# Altium schematic sheet PSU.SchDoc
size A4
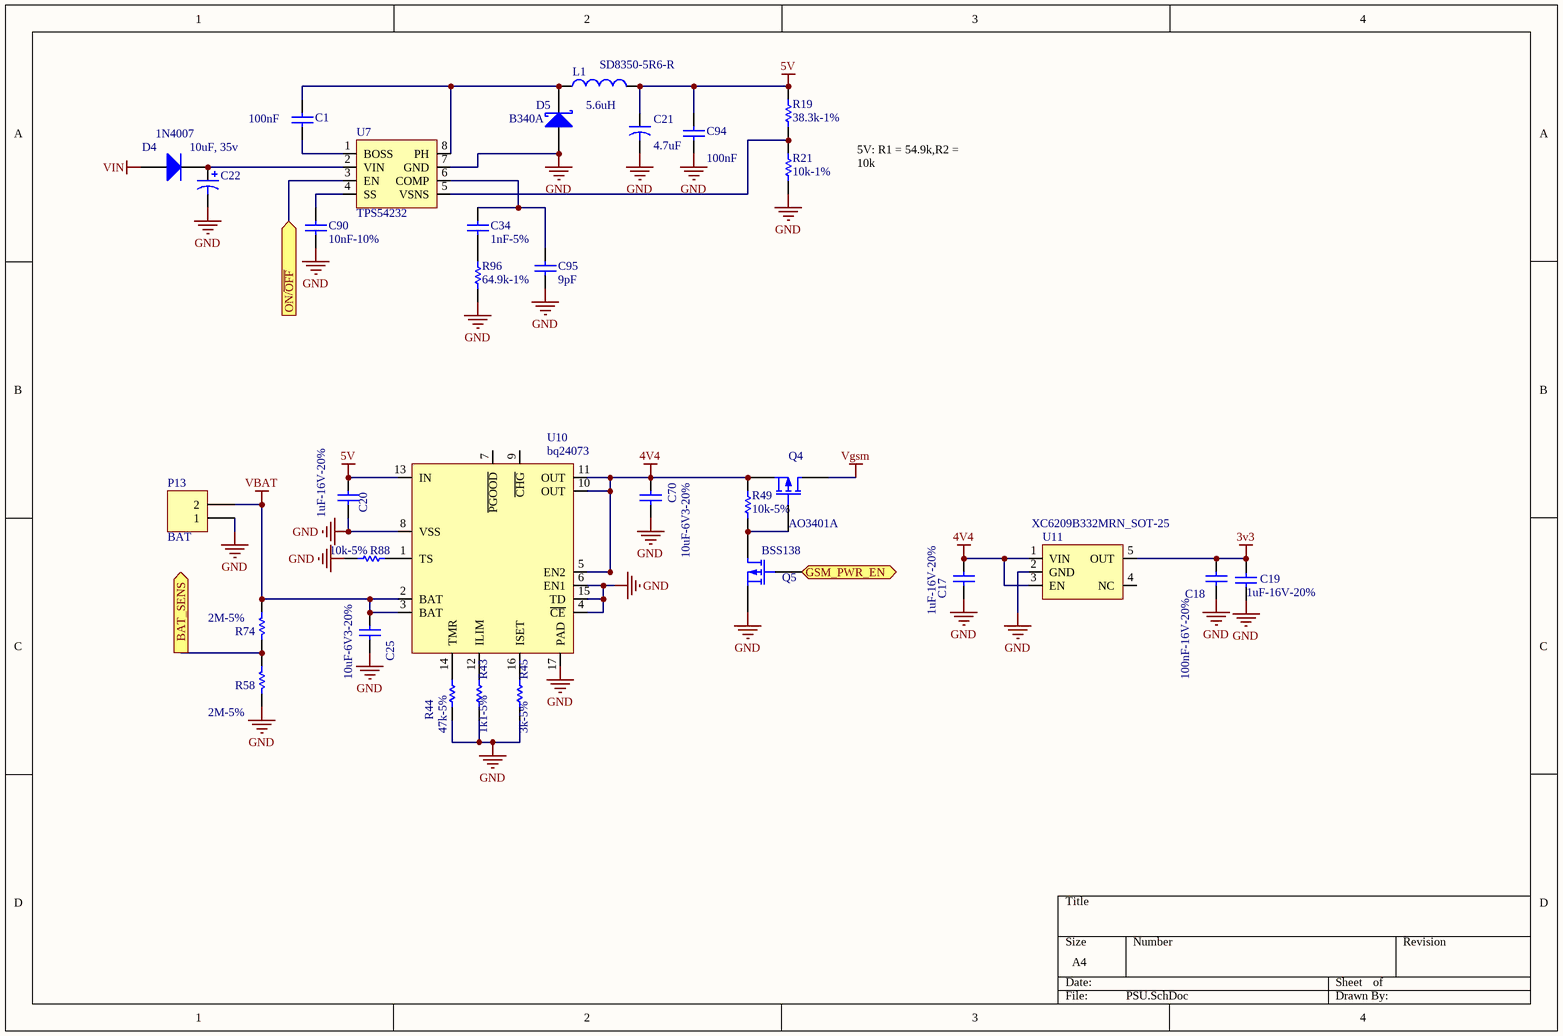
[diagram p0: PSU.SchDoc]

## Parts
C1  100nF  [0402_TYPE1]
C17  1uF-16V-20%  [C0603]
C18  100nF-16V-20%  [0402_TYPE1]
C19  1uF-16V-20%  [C0603]
C20  1uF-16V-20%  [C0603]
C21  4.7uF  [C1206]
C22  10uF, 35v  [CAPACITOR SIZE_C(D5.3)]
C25  10uF-6V3-20%  [C0603]
C34  1nF-5%  [0402_TYPE1]
C70  10uF-6V3-20%  [C0603]
C90  10nF-10%  [0402_TYPE1]
C94  100nF  [0402_TYPE1]
C95  9pF  [0402_TYPE1]
D4  1N4007  [DO-214AC (SMA)]
D5  B340A  [DO-214AC (SMA)]
L1  SD8350-5R6-R  value 5.6uH  [SD8350-5R6-R]
P13  BAT  [HDR1X2]
Q4  AO3401A  [SOT23-3]
Q5  BSS138  [SOT23-3]
R19  38.3k-1%  [R0402_TYPE1]
R21  10k-1%  [R0402_TYPE1]
R43  1k1-5%  [R0402_TYPE1]
R44  47k-5%  [R0402_TYPE1]
R45  3k-5%  [R0402_TYPE1]
R49  10k-5%  [R0402_TYPE1]
R58  2M-5%  [R0402_TYPE1]
R74  2M-5%  [R0402_TYPE1]
R88  10k-5%  [R0402_TYPE1]
R96  64.9k-1%  [R0402_TYPE1]
U7  TPS54232  [SOIC127P600-8AL]
U10  bq24073  [pq24073]
U11  XC6209B332MRN_SOT-25  [SOT23-5]

## Ports
BAT_SENS (out), GSM_PWR_EN (in), ON/~{OFF} (in)

## Nets
3v3: C18.2 C19.1 U11.5(OUT)
4V4: C17.1 C70.2 Q4.2(S) R49.1 U10.5(EN2) U10.10(OUT) U10.11(OUT) U11.1(VIN) U11.3(EN)
5V: C20.2 C21.1 C94.2 L1.2 R19.2 U10.13(IN)
GND: C17.2 C18.1 C19.2 C20.1 C21.2 C22.2 C25.1 C70.1 C90.1 C94.1 C95.1 D5.1(A) P13.1 Q5.2(S) R21.1 R43.2 R44.2 R45.2 R58.1 R88.2 R96.1 U7.7(GND) U10.4(~{CE}) U10.6(EN1) U10.8(VSS) U10.15(TD) U10.17(PAD) U11.2(GND)
VBAT: C25.2 P13.2 R74.2 U10.2(BAT) U10.3(BAT)
Vgsm: Q4.3(D)
VIN: D4.1(A)
BAT_SENS: R58.2 R74.1 ; port BAT_SENS
GSM_PWR_EN: Q5.1(G) ; port GSM_PWR_EN
ON/~{OFF}: U7.3(EN) ; port ON/~{OFF}
NetC1_1: C1.1 D5.2(K) L1.1 U7.8(PH)
NetC1_2: C1.2 U7.1(BOSS)
NetC22_1: C22.1 D4.2(K) U7.2(VIN)
NetC34_1: C34.1 R96.2
NetC34_2: C34.2 C95.2 U7.6(COMP)
NetC90_2: C90.2 U7.4(SS)
NetQ4_1: Q4.1(G) Q5.3(D) R49.2
NetR19_1: R19.1 R21.2 U7.5(VSNS)
NetR43_1: R43.1 U10.12(ILIM)
NetR44_1: R44.1 U10.14(TMR)
NetR45_1: R45.1 U10.16(ISET)
NetR88_1: R88.1 U10.1(TS)

Not connected (* = marked no-connect by the designer): U10 7(~{PGOOD}) 9(~{CHG}); U11 4(NC)

## Notes on the sheet
- 5V: R1 = 54.9k,R2 = 10k

## Library data of the parts
C1 C94 = Cap: Capacitor; Published: 8-Jun-2000; LatestRevisionDate: 17-Jul-2002; LatestRevisionNote: Re-released for DXP Platform.; PackageReference: RAD-0.3; Publisher: Altium Limited; Value: 100nF
C17 C19 C20 = Cap: CAP CER 1UF 16V Y5V 0603; Manufacturer: Yageo; Manufacturer Part Number: CC0603ZRY5V7BB105; Published: 8-Jun-2000; LatestRevisionDate: 17-Jul-2002; LatestRevisionNote: Re-released for DXP Platform.; PackageReference: C0603; Publisher: Altium Limited; Value: 1uF-16V-20%; Digi-Key Part Number: 311-1372-1-ND; Unit Price: 0.00465
C18 = Cap: CAP CER 0.1UF 16V Y5V 0402; Manufacturer: Yageo; Manufacturer Part Number: CC0402ZRY5V7BB104; Published: 8-Jun-2000; LatestRevisionDate: 17-Jul-2002; LatestRevisionNote: Re-released for DXP Platform.; PackageReference: C0402; Publisher: Altium Limited; Value: 100nF-16V-20%; Digi-Key Part Number: 311-1047-1-ND; Unit Price: 0.00250
C21 = Cap2: Capacitor; Published: 23-Sep-2002; PackageReference: CAPR5-4X5; Publisher: Altium Limited; Value: 4.7uF
C22 = Cap Pol3: CAP ALUM 10UF 35V 20% SMD; Manufacturer: Panasonic Electronic Components; Manufacturer Part Number: EEE-1VA100SR; Published: 8-Jun-2000; LatestRevisionDate: 29-May-2009; LatestRevisionNote: IPC-7351 Footprint Added.; PackageReference: C0805; Publisher: Altium Limited; PackageDescription: Chip Capacitor; Digi-Key Part Number: PCE3947TR-ND; Unit Price: 0.07875
C25 C70 = Cap: CAP CER 10UF 6.3V 20% X5R 0603; Manufacturer: Yageo; Manufacturer Part Number: CC0603MRX5R5BB106; Published: 8-Jun-2000; LatestRevisionDate: 17-Jul-2002; LatestRevisionNote: Re-released for DXP Platform.; PackageReference: C0603; Publisher: Altium Limited; Value: 10uF-6V3-20%; Digi-Key Part Number: 311-1448-1-ND; Unit Price: 0.06176
C34 = 1nF-50V-C0805: Non-Polarized Capacitor; Manufacturer: Yageo; Manufacturer Part Number: CC0805JRNPO9BN102; Value: 1nF-5%; Digi-Key Part Number: 311-1122-1-ND; Unit Price: 0.18
C90 = 10nF-50V-C0805: Non-Polarized Capacitor; Manufacturer: Yageo; Manufacturer Part Number: CC0805KRX7R9BB103; Value: 10nF-10%; Digi-Key Part Number: 311-1136-1-ND; Unit Price: 0.1
C95 = 9pF-50V-C0805: Non-Polarized Capacitor; Manufacturer: Yageo; Manufacturer Part Number: CC0805DRNPO9BN9R0; Value: 9pF; Digi-Key Part Number: 311-1098-1-ND; Unit Price: 0.1
D4 = Diode: DIODE GEN PURPOSE 1000V 1A SMA; Manufacturer Part Number: CGRA4007-G; Manufacturer: Comchip Technology; Published: 8-Jun-2000; LatestRevisionDate: 17-Jul-2002; LatestRevisionNote: Re-released for DXP Platform.; PackageVersion: Sep-1996; PackageReference: DO-214-AA; Publisher: Altium Limited; Code_JEDEC: DO-214-AB; Value: 1N4007; Digi-Key Part Number: 641-1018-1-ND; Unit Price: 0.05130
D5 = D Schottky: DIODE SCHOTTKY 40V 3A SMA; Manufacturer Part Number: B340A-E3/61T; Manufacturer: Vishay General Semiconductor; Published: 8-Jun-2000; LatestRevisionDate: 17-Jul-2002; LatestRevisionNote: Re-released for DXP Platform.; PackageReference: DO-214-AA; Publisher: Altium Limited; Code_JEDEC: DO-214-AA; Unit Price: 0.15840; Digi-Key Part Number: B340A-E3/61TGITR-ND
L1 = Inductor: Digikey part SD8350-4R7-R; Code_IEC: 1005; Published: 8-Jun-2000; LatestRevisionDate: 29-May-2009; LatestRevisionNote: IPC-7351 Footprint Added.; PackageReference: 0402-A; Publisher: Altium Limited; PackageDescription: Chip Inductor; Code_JEITA: 0402
P13 = Header 2: Header, 2-Pin; LatestRevisionDate: 17-Jul-2002; LatestRevisionNote: Re-released for DXP Platform.; Publisher: Altium Limited
Q4 = MOSFET-P: MOSFET P-CH -30V -4.3A SOT23; Manufacturer: Alpha & Omega Semiconductor Inc; Remark: NA; Published: 8-Jun-2000; LatestRevisionDate: 17-Jul-2002; LatestRevisionNote: Re-released for DXP Platform.; PackageVersion: 1995/1996; PackageReference: E3; Publisher: Altium Limited; Digi-Key Part Number: 785-1001-1-ND; Manufacturer Part Number: AO3401A; Unit Price: 0.12400
Q5 = MOSFET-P: MOSFET N-CH 50V 200MA SOT23-3; Manufacturer: Diodes Inc; Manufacturer Part Number: BSS138-7-F; Published: 8-Jun-2000; LatestRevisionDate: 17-Jul-2002; LatestRevisionNote: Re-released for DXP Platform.; PackageVersion: 1995/1996; PackageReference: E3; Publisher: Altium Limited; Digi-Key Part Number: BSS138-FDICT-ND; Unit Price: 0.06575
R19 = 38.3k-1%-R0805: RES 38.3k OHM 1/4W 1% 0805 SMD; Manufacturer: Yageo; Manufacturer Part Number: RC0805FR-0738K3L; Digi-Key Part Number: 311-38.3KCRTR-ND; Unit Price: 0.00241
R21 = 10k-1%-R0805: RES 10k OHM 1/4W 1% 0805 SMD; Manufacturer: Yageo; Manufacturer Part Number: RC0805FR-0710KL; Digi-Key Part Number: 311-10.0KCRTR-ND; Unit Price: 0.00241
R43 = Res1: RES 1.1K OHM 1/16W 5% 0402 SMD; Manufacturer: Yageo; Manufacturer Part Number: RC0402JR-071K1L; Published: 8-Jun-2000; LatestRevisionDate: 17-Jul-2002; LatestRevisionNote: Re-released for DXP Platform.; PackageReference: R0603; Publisher: Altium Limited; Value: 1k1-5%; Digi-Key Part Number: 311-1.1KJRCT-ND; Unit Price: 0.00207
R44 = Res1: RES 47K OHM 1/16W 5% 0402 SMD; Manufacturer: Yageo; Manufacturer Part Number: RC0402JR-0747KL; Published: 8-Jun-2000; LatestRevisionDate: 17-Jul-2002; LatestRevisionNote: Re-released for DXP Platform.; PackageReference: R0603; Publisher: Altium Limited; Value: 47k-5%; Digi-Key Part Number: 311-47KJRCT-ND; Unit Price: 0.00178
R45 = Res1: RES 1.5K OHM 1/16W 5% 0402 SMD; Manufacturer: Yageo; Manufacturer Part Number: RC0402JR-073KL; Published: 8-Jun-2000; LatestRevisionDate: 17-Jul-2002; LatestRevisionNote: Re-released for DXP Platform.; PackageReference: R0603; Publisher: Altium Limited; Value: 3k-5%; Digi-Key Part Number: 311-3.0KJRCT-ND; Unit Price: 0.00207
R49 R88 = Res1: RES 10K OHM 1/16W 5% 0402 SMD; Manufacturer: Yageo; Manufacturer Part Number: RC0402JR-0710KL; Published: 8-Jun-2000; LatestRevisionDate: 17-Jul-2002; LatestRevisionNote: Re-released for DXP Platform.; PackageReference: R0603; Publisher: Altium Limited; Value: 10k-5%; Digi-Key Part Number: 311-10KJRCT-ND; Unit Price: 0.00178
R58 = Res1: RES 100K OHM 1/16W 5% 0402 SMD; Manufacturer: Samsung Electro-Mechanics America, Inc; Manufacturer Part Number: RC1005F205CS; Published: 8-Jun-2000; LatestRevisionDate: 17-Jul-2002; LatestRevisionNote: Re-released for DXP Platform.; PackageReference: R0402; Publisher: Altium Limited; Value: 2M-5%; Digi-Key Part Number: 1276-4293-2-ND; Unit Price: 0.00171
R74 = Res1: RES 2M OHM 1/16W 1% 0402; Manufacturer: Samsung Electro-Mechanics America, Inc; Manufacturer Part Number: RC1005F205CS; Published: 8-Jun-2000; LatestRevisionDate: 17-Jul-2002; LatestRevisionNote: Re-released for DXP Platform.; PackageReference: R0402; Publisher: Altium Limited; Value: 2M-5%; Digi-Key Part Number: 1276-4293-2-ND; Unit Price: 0.00171
R96 = 64.9k-1%-R0805: RES 64.9k OHM 1/4W 1% 0805 SMD; Manufacturer: Yageo; Manufacturer Part Number: RC0805FR-0764K9L; Digi-Key Part Number: 311-64.9KCRTR-ND; Unit Price: 0.00241
U7 = Component_1
U10 = BATTERY_CHARGER: IC LI-ION CHARGE/PWR MGMT 16-QFN; Manufacturer: Texas Instruments; Manufacturer Part Number: BQ24073RGTT; Digi-Key Part Number: 296-23839-1-ND; Unit Price: 1.00; PackageReference: QFN, 16-Leads; Value: bq24073
U11 = XC6209B332MRN_SOT-25: Manufacturer: Tyrone